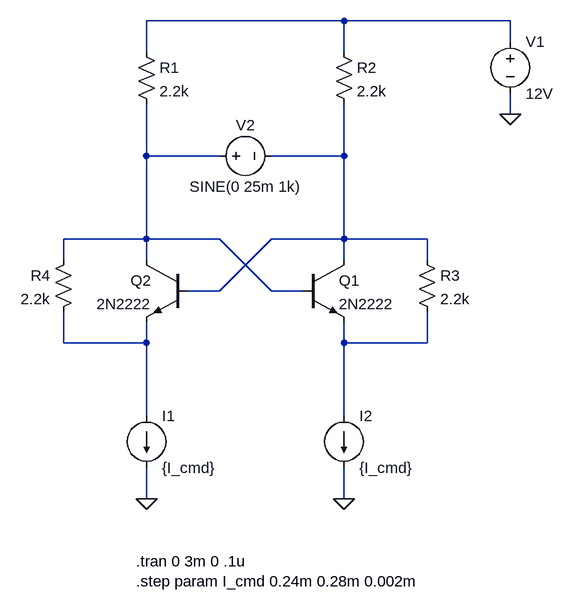
[diagram p0: schematic phaser_study_1.asc]
phaser_study_1.asc, the LTspice schematic file:
Version 4
SHEET 1 880 732
WIRE 192 -144 -112 -144
WIRE 448 -144 192 -144
WIRE 448 -112 448 -144
WIRE -112 -96 -112 -144
WIRE 192 -96 192 -144
WIRE 448 0 448 -32
WIRE -112 64 -112 -16
WIRE 0 64 -112 64
WIRE 192 64 192 -16
WIRE 192 64 80 64
WIRE -112 192 -112 64
WIRE -112 192 -240 192
WIRE 0 192 -112 192
WIRE 192 192 192 64
WIRE 192 192 80 192
WIRE 320 192 192 192
WIRE -240 224 -240 192
WIRE -112 224 -112 192
WIRE 192 224 192 192
WIRE 320 224 320 192
WIRE 0 272 80 192
WIRE 0 272 -48 272
WIRE 80 272 0 192
WIRE 128 272 80 272
WIRE -240 352 -240 304
WIRE -112 352 -112 320
WIRE -112 352 -240 352
WIRE 192 352 192 320
WIRE 320 352 320 304
WIRE 320 352 192 352
WIRE -112 464 -112 352
WIRE 192 464 192 352
WIRE -112 592 -112 544
WIRE 192 592 192 544
FLAG 448 0 0
FLAG -112 592 0
FLAG 192 592 0
SYMBOL npn2 128 224 R0
SYMATTR InstName Q1
SYMATTR Value 2N2222
SYMBOL voltage 448 -128 R0
WINDOW 123 0 0 Left 0
WINDOW 39 0 0 Left 0
SYMATTR InstName V1
SYMATTR Value 12V
SYMBOL npn2 -48 224 M0
SYMATTR InstName Q2
SYMATTR Value 2N2222
SYMBOL current -112 464 R0
WINDOW 123 0 0 Left 0
WINDOW 39 0 0 Left 0
SYMATTR InstName I1
SYMATTR Value {I_cmd}
SYMBOL current 192 464 R0
WINDOW 123 0 0 Left 0
WINDOW 39 0 0 Left 0
SYMATTR InstName I2
SYMATTR Value {I_cmd}
SYMBOL res -128 -112 R0
SYMATTR InstName R1
SYMATTR Value 2.2k
SYMBOL res 176 -112 R0
SYMATTR InstName R2
SYMATTR Value 2.2k
SYMBOL voltage -16 64 R270
WINDOW 0 32 56 VTop 2
WINDOW 3 -32 56 VBottom 2
WINDOW 123 0 0 Left 0
WINDOW 39 0 0 Left 0
SYMATTR InstName V2
SYMATTR Value SINE(0 25m 1k)
SYMBOL res 304 208 R0
SYMATTR InstName R3
SYMATTR Value 2.2k
SYMBOL res -224 208 M0
SYMATTR InstName R4
SYMATTR Value 2.2k
TEXT -128 688 Left 2 !.tran 0 3m 0 .1u\n.step param I_cmd 0.24m 0.28m 0.002m

The netlist it stands for:
* phaser_study_1.asc
Q1 N003 N002 N005 0 2N2222
V1 N001 0 12V
Q2 N002 N003 N004 0 2N2222
I1 N004 0 {I_cmd}
I2 N005 0 {I_cmd}
R1 N001 N002 2.2k
R2 N001 N003 2.2k
V2 N002 N003 SINE(0 25m 1k)
R3 N003 N005 2.2k
R4 N002 N004 2.2k
.model NPN NPN
.model PNP PNP
.lib standard.bjt
.tran 0 3m 0 .1u
.step param I_cmd 0.24m 0.28m 0.002m
.backanno
.end